# EAGLE design EAT0003 (EAGLE 7.2.0)
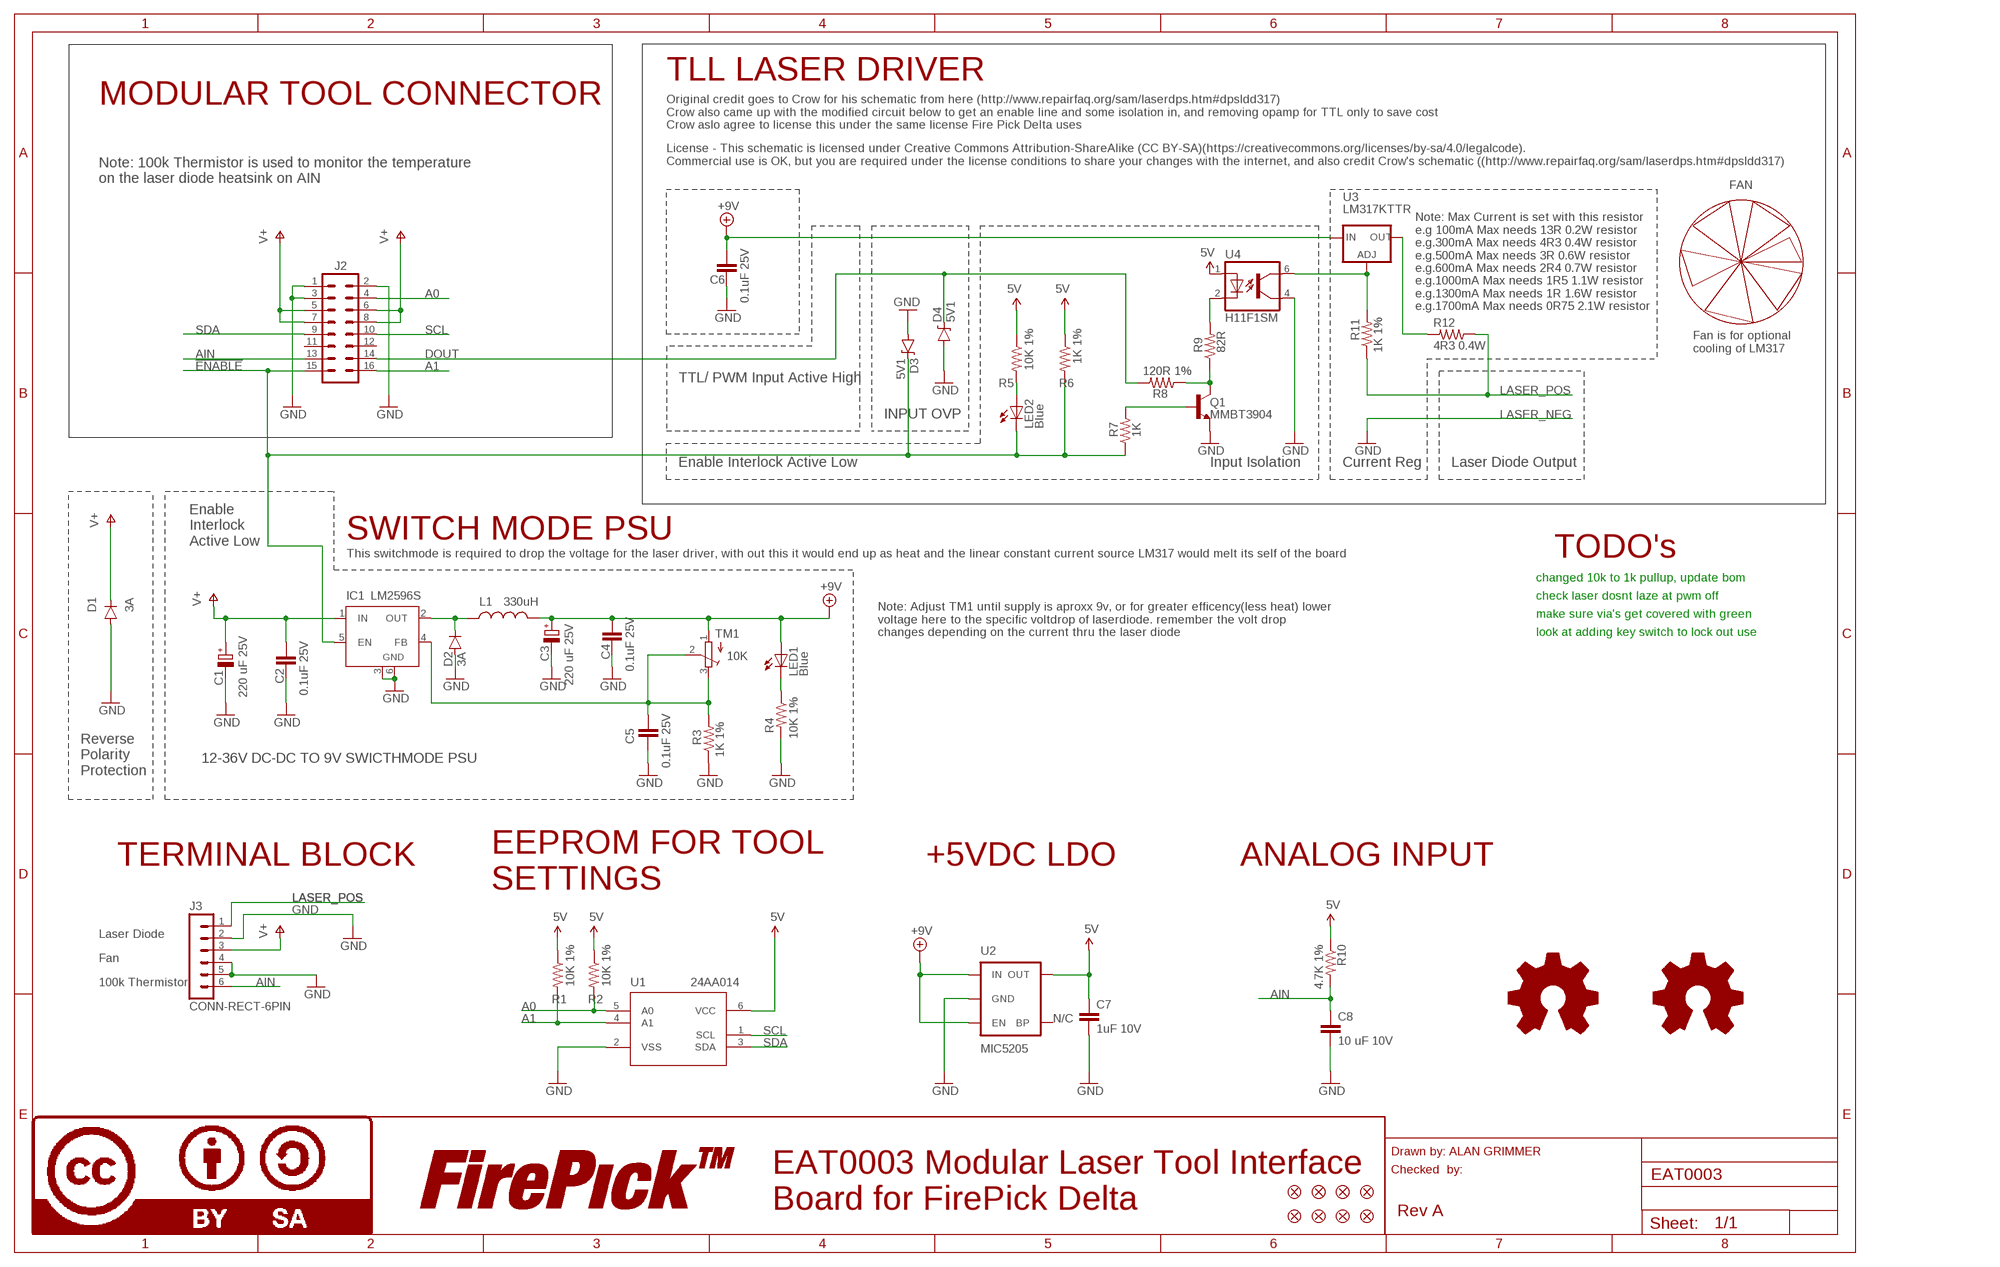
[diagram p0: schematic, sheet 1]

## Parts
C1  220 uF 25V  CPOL-EUUD-8X10  [UD-8X10_NICHICON]
C2  0.1uF 25V  CAP0603-CAP  [0603-CAP]
C3  220 uF 25V  CPOL-EUUD-8X10  [UD-8X10_NICHICON]
C4  0.1uF 25V  CAP0603-CAP  [0603-CAP]
C5  0.1uF 25V  CAP0603-CAP  [0603-CAP]
C6  0.1uF 25V  CAP0603-CAP  [0603-CAP]
C7  1uF 10V  CAP0603-CAP  [0603-CAP]
C8  10 uF 10V  CAP0805  [0805]
D1  3A  DIODESMA  [SMA-DIODE]
D2  3A  DIODESMA  [SMA-DIODE]
D3  5V1  DIODE-ZENER5.6V  [SOD-323]
D4  5V1  DIODE-ZENER5.6V  [SOD-323]
FAN1  FAN_30MM  [FAN_30MM_X_30MM]
FID1  FIDUCIAL1X2  [FIDUCIAL-1X2]
FID2  FIDUCIAL1X2  [FIDUCIAL-1X2]
FID3  FIDUCIAL1X2  [FIDUCIAL-1X2]
FID4  FIDUCIAL1X2  [FIDUCIAL-1X2]
FID5  FIDUCIAL1X2  [FIDUCIAL-1X2]
FID6  FIDUCIAL1X2  [FIDUCIAL-1X2]
FID7  FIDUCIAL1X2  [FIDUCIAL-1X2]
FID8  FIDUCIAL1X2  [FIDUCIAL-1X2]
IC1  LM2596S  [TO263-5]
J2  CONN-RECT-16PIN-2ROWSIDE  [CONN-RECT-2.54MM-16PIN-2ROW-SIDE]
J3  CONN-RECT-6PIN  [CONN-OSTTE_6PIN]
L1  330uH  INDUCTORPWR  [CDRH125]
LED1  Blue  LEDCHIPLED_0603  [CHIPLED_0603]
LED2  Blue  LEDCHIPLED_0603  [CHIPLED_0603]
LOGO1  LOGO-CC-BY-SASMALL  [LOGO-CC-BY-SA-SMALL]
LOGO2  LOGO-FIREPICKSMALL  [LOGO-FIREPICK-SMALL]
LOGO3  LOGO-OSHWSMALL  [LOGO-OSHW-SMALL]
LOGO4  LOGO-OSHWSMALL  [LOGO-OSHW-SMALL]
LOGO5  LOGO-CC-BY-SASMALL  [LOGO-CC-BY-SA-SMALL]
LOGO6  LOGO-FIREPICKSMALL  [LOGO-FIREPICK-SMALL]
Q1  MMBT3904  TRANSISTOR_NPNMMBT2222A  [SOT23-3]
R1  10K 1%  RESISTOR0603-RES  [0603-RES]
R2  10K 1%  RESISTOR0603-RES  [0603-RES]
R3  1K 1%  RESISTOR0603-RES  [0603-RES]
R4  10K 1%  RESISTOR0603-RES  [0603-RES]
R5  10K 1%  RESISTOR0603-RES  [0603-RES]
R6  1K 1%  RESISTOR0603-RES  [0603-RES]
R7  1K  RESISTOR0603-RES  [0603-RES]
R8  120R 1%  RESISTOR0603-RES  [0603-RES]
R9  82R  RESISTOR0603-RES  [0603-RES]
R10  4.7K 1%  RESISTOR0603-RES  [0603-RES]
R11  1K 1%  RESISTOR0603-RES  [0603-RES]
R12  4R3 0.4W  RESISTOR2512  [R2512]
TM1  10K  TRIMPOTTC33X  [TC33X]
U1  24AA014  IC-24AA014  [SOT23-6]
U2  MIC5205  MIC52055V  [SOT23-5]
U3  LM317KTTR  V_REG_317  [D2PAK-3]
U4  H11F1SM  H11F1DIL6SMD  [DIL6-SMD]

## Nets
5V [power]: C7.1 R1.1 R2.1 R5.1 R6.1 R10.1 U1.6(VCC) U2.5(OUT) U4.1(A)
!ENABLE: D3.C IC1.5(EN) J2.15 LED2.C R6.2 R7.1
+9V [power-12V]: C3.+ C4.1 C6.1 L1.2 LED1.A TM1.1(A) U2.1(IN) U2.3(EN) U3.3(IN)
A0: J2.4 R2.2 U1.5(A0)
A1: J2.16 R1.2 U1.4(A1)
AIN: C8.1 J2.13 J3.6 R10.2
DOUT: D4.C J2.14 R8.2
GND: C1.- C2.2 C3.- C4.2 C5.2 C6.2 C7.2 C8.2 D1.A D2.A D3.A D4.A IC1.3(GND) IC1.6(GND) J2.1 J2.2 J2.3 J3.2 J3.4 J3.5 Q1.2(E) R3.1 R4.2 U1.2(VSS) U2.2(GND) U4.4(EMIT)
LASER_POS: J3.1 R11.1 R12.1
N$1: Q1.3(C) R8.1 R9.1
N$3: D2.C IC1.2(OUT) L1.1
N$4: R11.2 U3.1(ADJ) U4.6(COL)
N$7: R12.2 U3.2(OUT) U3.PAD(OUT)
N$8: LED1.C R4.1
N$9: R9.2 U4.2(C)
N$10: Q1.1(B) R7.2
N$18: LED2.A R5.2
N$23: C5.1 IC1.4(FB) R3.2 TM1.2(S) TM1.3(E)
SCL: J2.10 U1.1(SCL)
SDA: J2.9 U1.3(SDA)
V+ [power-12V]: C1.+ C2.1 D1.C IC1.1(IN) J2.5 J2.6 J2.7 J2.8 J3.3
Unconnected: J2.11 J2.12 U2.4(BP)

## Notes on the sheet
- TLL LASER DRIVER
- MODULAR TOOL CONNECTOR
- Original credit goes to Crow for his schematic from here (http://www.repairfaq.org/sam/laserdps.htm#dpsldd317) 
  Crow also came up with the modified circuit below to get an enable line and some isolation in, and removing opamp for TTL only to save cost
  Crow aslo agree to license this under the same license Fire Pick Delta uses
- License - This schematic is licensed under Creative Commons Attribution-ShareAlike (CC BY-SA)(https://creativecommons.org/licenses/by-sa/4.0/legalcode). 
  Commercial use is OK, but you are required under the license conditions to share your changes with the internet, and also credit Crow's schematic ((http://www.repairfaq.org/sam/laserdps.htm#dpsldd317)
- Note: 100k Thermistor is used to monitor the temperature 
  on the laser diode heatsink on AIN
- FAN
- Note: Max Current is set with this resistor
  e.g 100mA Max needs 13R 0.2W resistor
  e.g.300mA Max needs 4R3 0.4W resistor
  e.g.500mA Max needs 3R 0.6W resistor
  e.g.600mA Max needs 2R4 0.7W resistor
  e.g.1000mA Max needs 1R5 1.1W resistor
  e.g.1300mA Max needs 1R 1.6W resistor
  e.g.1700mA Max needs 0R75 2.1W resistor
- Fan is for optional 
  cooling of LM317
- TTL/ PWM Input Active High
- INPUT OVP | LASER_NEG
- Enable Interlock Active Low | Input Isolation | Current Reg | Laser Diode Output
- SWITCH MODE PSU
- Enable 
  Interlock 
  Active Low
- This switchmode is required to drop the voltage for the laser driver, with out this it would end up as heat and the linear constant current source LM317 would melt its self of the board | TODO's
- changed 10k to 1k pullup, update bom
- check laser dosnt laze at pwm off
- make sure via's get covered with green
- Note: Adjust TM1 until supply is aproxx 9v, or for greater efficency(less heat) lower 
  voltage here to the specific voltdrop of laserdiode. remember the volt drop 
  changes depending on the current thru the laser diode
- look at adding key switch to lock out use
- 12-36V DC-DC TO 9V SWICTHMODE PSU
- Reverse
  Polarity
  Protection
- TERMINAL BLOCK | +5VDC LDO | ANALOG INPUT
- EEPROM FOR TOOL 
  SETTINGS
- Laser Diode
- Fan
- 100k Thermistor
- N/C
- Drawn by: ALAN GRIMMER
- Checked  by:
- EAT0003 Modular Laser Tool Interface 
  Board for FirePick Delta
- Rev A

## Library data of the parts
C1 C3 = rcl:CPOL-EU: POLARIZED CAPACITOR, European symbol
C2 C4-C8 = SparkFun-Capacitors:CAP: Capacitor Standard 0603 ceramic capacitor, and 0.1" leaded capacitor.
D1 D2 = SparkFun-DiscreteSemi:DIODE: Diode These are standard reverse protection diodes and small signal diodes. SMA package can handle up to about 1A. SOD-323 can handle about 200mA. What the SOD-323 package when ordering, there are some mfgs out there that are 5-pin packages.
D3 D4 = SparkFun-DiscreteSemi:DIODE-ZENER: Zener Diode Production Part - 8199 3.4V Zener Voltage; PROD_ID: DIO-12442; VALUE: 5.6V
FAN1 = fan:FAN_30MM
FID1-FID8 = SparkFun-Aesthetics:FIDUCIAL: Fiducial Alignment Points Various fiducial points for machine vision alignment.
IC1 = linear:LM2596S: STEP-DOWN VOLTAGE REGULATOR
J2 = FirePick:CONN-RECT-16PIN-2ROW
J3 = CONN_FPD:CONN-RECT-6PIN
L1 = SparkFun-Passives:INDUCTOR: Inductors Basic Inductor/Choke - 0603 and 1206. Footprints are not proven and vary greatly between part numbers. SRN6045- 33uH, 20% 1.4A SDR0403-560KL - 56uH, 10%, 500mA RMS/740mA peak
LED1 LED2 = adafruit:LED: LED OSRAM: - CHIPLED LG R971, LG N971, LY N971, LG Q971, LY Q971, LO R971, LY R971 LH N974, LH R974 LS Q976, LO Q976, LY Q976 LO Q996 - Hyper CHIPLED LW Q18S LB Q993, LB Q99A, LB R99A - SideLED LS A670, LO A670, LY A670, LG A670, LP A670 LB A673, LV A673, LT A673, LW A673 LH A674 LY A675 LS A676, LA A676, LO A676, LY A676, LW A676 LS A679, LY A679, LG A679 - Hyper Micro SIDELED® LS Y876, LA Y876, LO Y876, LY Y876 LT Y87S - SmartLED LW L88C, LW L88S LB L89C, LB L89S, LG L890 LS L89K, LO L89K, LY L89K LS L896, LA L896, LO L896, LY L896 - TOPLED LS T670, LO T670, LY T670, LG T670, LP T670 LSG T670, LSP T670, LSY T670, LOP T670, LYG T670 LG T671, LOG T671, LSG T671 LB T673, LV T673, LT T673, LW T673 LH T674 LS T676, LA T676, LO T676, LY T676, LB T676, LH T676, LSB T676, LW T676 LB T67C, LV T67C, LT T67C, LS T67K, LO T67K, LY T67K, LW E67C LS E67B, LA E67B, LO E67B, LY E67B, LB E67C, LV E67C, LT E67C LW T67C LS T679, LY T679, LG T679 LS T770, LO T770, LY T770, LG T770, LP T770 LB T773, LV T773, LT T773, LW T773 LH T774 LS E675, LA E675, LY E675, LS T675 LS T776, LA T776, LO T776, LY T776, LB T776 LHGB T686 LT T68C, LB T68C - Hyper Mini TOPLED® LB M676 - Mini TOPLED Santana® LG M470 LS M47K, LO M47K, LY M47K Source: http://www.osram.convergy.de/
LOGO1 LOGO5 = FirePick:LOGO-CC-BY-SA; BOM: EXCLUDE; DNP: T
LOGO2 LOGO6 = FirePick:LOGO-FIREPICK; BOM: EXCLUDE; DNP: T
LOGO3 LOGO4 = FirePick:LOGO-OSHW; BOM: EXCLUDE; DNP: TRUE
Q1 = SparkFun-DiscreteSemi:TRANSISTOR_NPN: Generic NPN BJT MMBT2222A - TRANS-08049 (SOT-23, 1A 40V) MPSA42 - TRANS-09116 (SOT-23, 500mA 300V) MMBT5088LT1G - TRANS-11160 (SOT-23, 50 mA 30V) BC547 - COM-08928 <http://www.sparkfun.com/products/8928> (TO-92 45V 100mA) (1.Collector 2.Base 3.Emitter) 2N3904 - COM-00521 <http://www.sparkfun.com/products/521> (TO-92 40V 200mA) (1.Emitter 2.Base 3.Collector) P2N2222A - COM-12852 <http://www.sparkfun.com/products/12852> (TO-92 40V 600mA) (1.Collector 2.Base 3.Emitter); PROD_ID: TRANS-08049; VALUE: MMBT2222A
R1-R12 = SparkFun-Resistors:RESISTOR: Resistor Basic schematic elements and footprints for 0603, 1206, and PTH resistors.
TM1 = adafruit:TRIMPOT: SMT trimmer potentiometer part number TC33X http://www.ladyada.net/library/eagle
U1 = FirePick:IC-24AA014
U2 = SparkFun-PowerIC:MIC5205: MIC5205 150mA vreg 3.3V - VREG-00822 5V - VREG-00823; PROD_ID: VREG-00823
U3 = LM317:V_REG_317: Voltage Regulator Standard LM317 adjustable voltage regulator. AOI (Adjust Output Input). Google 'LM317 Calculator' for easy to use app to get the two resistor values needed. 240/720 for 5V output. 240/390 for 3.3V output. Spark Fun Electronics SKU : COM-00527
U4 = H11F1SM:H11F1: OPTO COUPLER OPTO COUPLER

## Net classes
0 default: width 0.3 mm, drill 0.3 mm, clearance 0.3 mm
1 power: width 0.3 mm, drill 0.3 mm, clearance 0.3 mm
2 power-12V: width 0.3 mm, drill 0.3 mm, clearance 0.3 mm

## Board
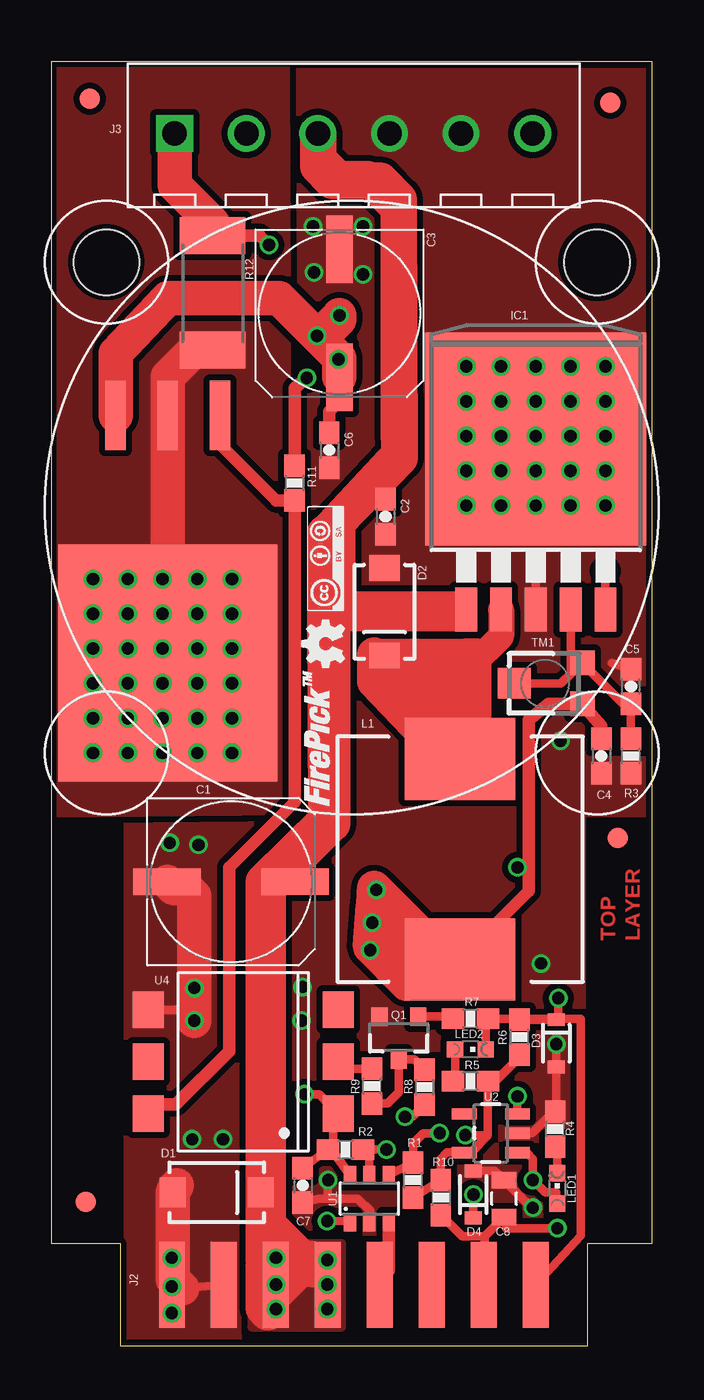
[diagram p1: board, top side]
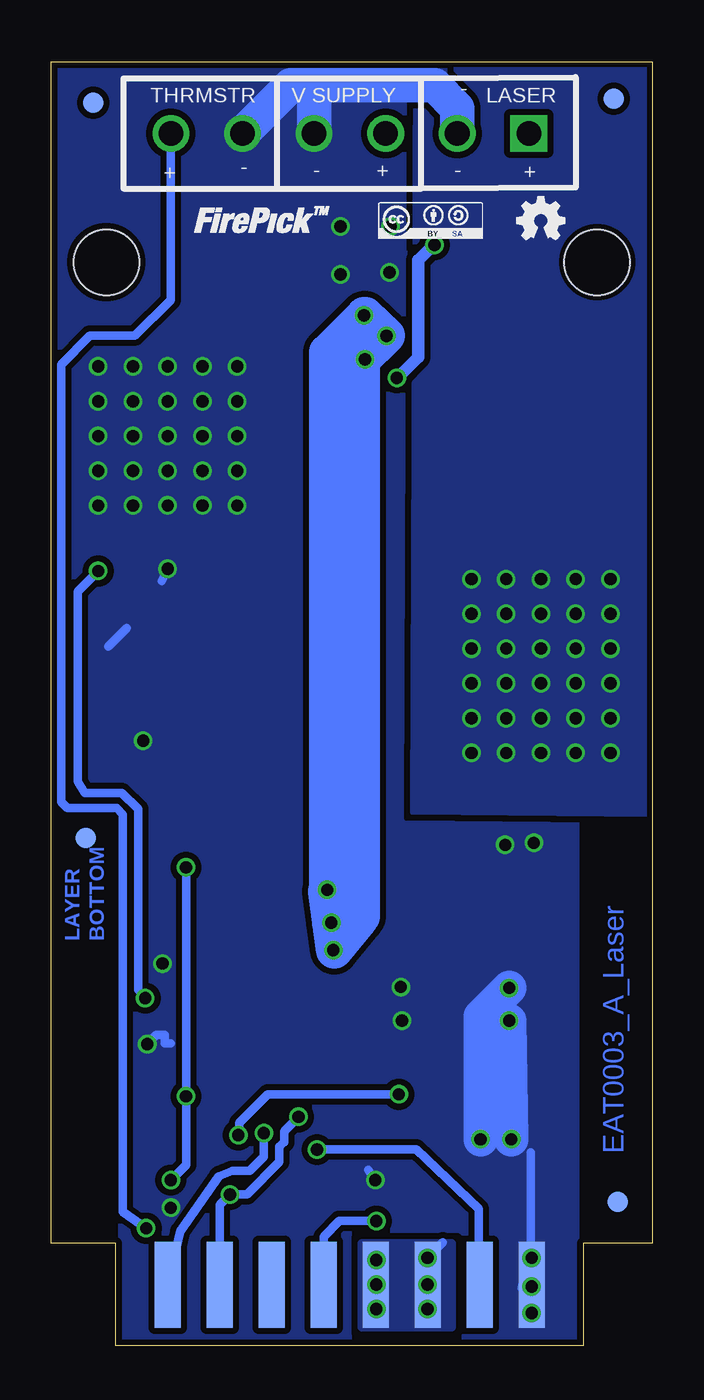
[diagram p2: board, bottom side, seen from below]

Size 29.4 x 62.8 mm. Coordinates in mm from the lower left corner, seen from the top.
Outline: 3.37,0 26.23,0 26.23,5 29.4,5 29.4,62.8 0,62.8 0,5 3.37,5 3.37,0
Copper layers (1*16): Top 0.035mm / dielectric 1.5mm / Bottom 0.035mm
Design rules "SeeedStudio_2layer_DRU_no_angle_20140221": minimum track width 6mil, minimum drill 12mil, track to track 6mil, track to pad 6mil, pad to pad 6mil, via to via 6mil, smd to smd 0mil, copper to edge 10mil, drill to drill 10mil, minimum pad ring 10mil, minimum via ring 6mil, stop-mask expansion 2mil, vias tented up to drill 100mil, thermal gap 10mil

### Footprints (pad centres in the part's own frame; a part is rotated, then mirrored left to right if it is on the bottom)
UD-8X10_NICHICON = smd 3.3 x 1.3: + 3.125,0; - -3.125,0
0603-CAP = smd 1.1 x 1: 1 -0.85,0; 2 0.85,0
0805 = smd 0.8 x 1.2: 1 -0.9,0; 2 0.9,0
SMA-DIODE = smd 1.27 x 1.47: A -2.15,0; C 2.15,0
SOD-323 = smd 0.63 x 0.83: A 1.15,0; C -1.15,0
FAN_30MM_X_30MM = hole 3.2: -12,12; 12,12
FIDUCIAL-1X2 = smd 1 x 1: 1 0,0
TO263-5 = smd 1.067 x 2.159: 1 -3.404,-5.791; 2 -1.702,-5.791; 3 0,-5.791; 4 1.702,-5.791; 5 3.404,-5.791 | smd 10.8 x 10.41: 6 0,2.54
CONN-RECT-2.54MM-16PIN-2ROW-SIDE = smd 1.27 x 4.2: 1 -8.89,-0.02; 3 -6.35,-0.02; 5 -3.81,-0.02; 7 -1.27,-0.02; 9 1.27,-0.02; 11 3.81,-0.02; 13 6.35,-0.02; 15 8.89,-0.02 | smd 1.27 x 4.2 bottom: 2 -8.89,-0.02; 4 -6.35,-0.02; 6 -3.81,-0.02; 8 -1.27,-0.02; 10 1.27,-0.02; 12 3.81,-0.02; 14 6.35,-0.02; 16 8.89,-0.02
CONN-OSTTE_6PIN = drill 1.2 square: 1 -8.758,0 | drill 1.2: 2 -5.258,0; 3 -1.758,0; 4 1.742,0; 5 5.242,0; 6 8.742,0
CDRH125 = smd 5.4 x 4: 1 0,4.9; 2 0,-4.9
CHIPLED_0603 = smd 0.8 x 0.8: A 0,-0.75; C 0,0.75
SOT23-3 = smd 0.8 x 0.9: 1 -0.95,-1; 2 0.95,-1; 3 0,1.1
0603-RES = smd 1.1 x 1: 1 -0.85,0; 2 0.85,0
R2512 = smd 1.8 x 3.2: 1 -2.8,0; 2 2.8,0
TC33X = smd 1.2 x 1.2: 1 -1,-1.825; 3 1,-1.825 | smd 1.5 x 1.6: 2 0,1.5
SOT23-6 = smd 0.6 x 0.9: 1 -0.95,-1.15; 2 0,-1.15; 3 0.95,-1.15; 4 0.95,1.15; 5 0,1.15; 6 -0.95,1.15
SOT23-5 = smd 0.55 x 1.2: 1 -0.95,-1.3; 2 0,-1.3; 3 0.95,-1.3; 4 0.95,1.3; 5 -0.95,1.3
D2PAK-3 = smd 1 x 3.4: 1 -2.55,-10.6; 2 0,-10.6; 3 2.55,-10.6 | smd 10.7 x 11.6: PAD 0,1.5
DIL6-SMD = smd 1.78 x 1.52: 1 -2.54,-4.645; 2 0,-4.645; 3 2.54,-4.645; 4 2.54,4.645; 5 0,4.645; 6 -2.54,4.645

### Placement (x,y rotation side)
C1  8.8,22.7 0 top
C2  16.35,40.55 270 top
C3  14.1,50.5 270 top
C4  26.9,28.85 270 top
C5  28.35,32.25 90 top
C6  13.6,43.8 270 top
C7  12.3,7.85 270 top
C8  22.15,7.2 90 top
D1  8.1,7.5 0 top
D2  16.3,35.9 270 top
D3  24.7,14.8 270 top
D4  20.65,7.4 90 top
FAN1  14.7,41 0 top
FID1  27.7,24.85 0 bottom
FID2  1.7,7.05 0 bottom
FID3  1.7,7.05 0 top
FID4  1.9,61 0 top
FID5  27.35,60.8 0 top
FID6  27.7,24.85 90 top
FID7  27.35,60.8 0 bottom
FID8  1.9,61 0 bottom
IC1  23.7,41.8 0 top
J2  14.8,3 0 top
J3  14.8,59.3 0 top
L1  20,23.8 0 top
LED1  24.75,7.7 0 top
LED2  20.5,14.5 270 top
LOGO1  14.3,35.95 90 top
LOGO2  13.6,26.4 90 top
LOGO3  14.55,33.1 90 top
LOGO4  6.7,53.9 0 bottom
LOGO5  13.4,54.15 0 bottom
LOGO6  22.4,54.45 0 bottom
Q1  17,15.1 180 top
R1  17.7,8.1 90 top
R2  14.4,9.6 0 top
R3  28.35,28.85 90 top
R4  24.65,10.6 90 top
R5  20.5,12.95 180 top
R6  22.9,15.1 90 top
R7  20.5,16 180 top
R8  18.25,12.65 270 top
R9  15.7,12.7 90 top
R10  19.05,7.25 270 top
R11  11.9,42.2 270 top
R12  7.9,51.5 270 top
TM1  24.15,32.4 90 top
U1  15.56,7.2 0 top
U2  21.5,10.4 90 top
U3  5.7,34.9 180 top
U4  9.4,13.9 90 top

### Tracks (layer width: path | path; a pad name or v marks a point on that pad's centre or on a via)
5V  (via drill 0.6)
  Top 0.406: R2.1 13.85,9.3 13.8,9.55 13.8,11.2 | U1.6 13.86,9.4 13.76,9.6 R2.1 | R6.1 22.65,13.85 21.75,12.95 R5.1 21.35,10.3 | 13.8,11.2 13.8,11.6 13.1,12.3 v12.4,12.3 | C7.1 R2.1 | 19.85,9.5 U2.5 | 21.35,10.3 20.6,9.5 19.95,9.5 U2.5 | 21.35,10.3 v20.25,10.3 | U4.1 13.98,11.2 13.8,11.2 | R1.1 R10.1 19.05,9.15 19.35,9.45 U2.5
  Top 0.61: R2.1 13.64,9.7
  Bottom 0.406: v12.4,12.3 18.8,12.3 20.2,10.9 20.2,10.35 v20.25,10.3
!ENABLE  (via drill 0.6)
  Top 0.406: J2.15 25.9,5.39 25.9,16 24.8,16 | LED2.C 21.25,15.9 R7.1 | 24.8,16 v24.8,17 | v27.1,37.9 IC1.5 | 24.8,16 D3.C 24.55,16 24.4,16 | 24.4,16 R7.1 | R7.1 21.3,16 | 24.4,16 24.35,15.95 R6.2 22.85,16 R7.1
  Top 0.61: IC1.5
  Bottom 0.406: v27.1,37.9 28.1,36.9 28.1,27.6 27.75,27.05 25.95,27.05 25.15,26.25 25.15,17.4 v24.8,17
+9V  (via drill 0.6)
  Top 0.406: 22.45,11.3 U2.3 22.8,12 v22.8,12.2 | U2.1 22.5,9.45 23.25,9.45 23.55,9.15 v23.55,8.1 | 23.55,8.35 v23.55,8.1 | LED1.A 24.7,7.5 24.15,7.5 v23.55,8.1 | 15.6,19.5 v15.6,19.35 | 15.79,22.26 15.78,22.09 | 15.8,22.4 15.78,22.09 | 15.78,22.09 15.6,19.6 15.6,19.55 v15.9,22.3 14.95,19.55 15.1,21.55 15.78,21.15 15.78,22.09 | v14.05,48.25 C3.+
  Top 0.61: 23.35,23.35 23.35,30.6 24.3,31.4 TM1.1 26.9,30.32 C4.1 | L1.2 23.35,22.25 23.35,23.35 | v22.8,23.4 22.85,23.35 23.35,23.35 | C3.+ 14.1,46.95 14.2,46.85 14.2,46.3 13.6,45.7 C6.1
  Top 1.676: C3.+ 14.1,48.3 13.15,49.25 | 13.15,49.25 v13,49.4 | U3.3 3.15,48.55 5.7,51.25 11.15,51.25 v13,49.4 | v14.1,50.4 14.1,50.2 13.15,49.25 | v15.7,20.7 17.5,18.9 L1.2 19.3,18.9 v15.9,22.3 15.6,19.6 15.74,21.57 15.78,22.09 15.79,22.2 15.79,22.25 15.79,22.26 15.8,22.4 | v13,49.4 13.1,49.4 14,50.3 | 17.4,17.7 15.6,19.5
  Bottom 0.406: v22.8,23.4 v22.8,12.2 22.8,8.85 v23.55,8.1 | v15.9,22.3 15.95,22.25 | 15.85,22.3 15.8,22.4 | 15.8,22.4 v15.6,19.35 | 15.8,22.4 15.79,22.25 | 15.79,22.25 15.77,22.04 15.71,21.13 15.79,22.25 | 15.79,22.25 15.73,22.25 15.73,21.44 15.7,21.44 15.7,21.02 15.67,21.02 15.67,20.57 15.6,20.57 15.6,19.55 | 15.6,19.55 15.8,19.55 15.8,22.4 | 15.6,19.55 15.2,19.55 15.2,34.7 15.8,34.7 15.8,22.4
  Bottom 1.778: v15.9,22.3 15.9,48.6 v14.1,50.4 | 14.2,22.2 14.2,48.2 v13,49.4 | 14.2,22.2 15.8,22.2 v15.9,22.3 | v15.9,22.3 14.2,22.2 | 14.2,22.2 v15.7,20.7 | v15.7,20.7 15.75,20.65 15.85,22.3 v15.7,20.7 | v13,49.4 14.05,50.4 15.05,48 v13,49.4 | 14.3,20.85 15.55,19.35 15.95,22.25 | 14.2,21 14.2,22.2
A0  (via drill 0.6)
  Top 0.406: R2.2 15.56,9.49 U1.5 15.56,9.44 15.6,9.6 v16.4,9.6
  Bottom 0.406: v16.4,9.6 11.55,9.6 8.5,6.7 8.5,3.03 J2.4
  Bottom 0.61: J2.4 8.4,3.03
A1  (via drill 0.6)
  Top 0.406: 18.55,10.4 v19,10.4 18.2,10.4 17.7,9.9 R1.2 U1.4 16.55,8.39 16.55,8.45
  Bottom 0.406: J2.16 23.09,5.61 21.2,8.3 20.55,8.55 19.7,8.55 19,9.25 v19,10.4
AIN  (via drill 0.6)
  Top 0.406: 21.2,5.35 C8.1 22.25,6.2 22.25,5.75 v24.75,5.75 | 21.2,5.35 21.2,4 | R10.2 20.1,5.35 21.2,5.35
  Top 0.61: 21.2,4 21.2,3.03 J2.13
  Bottom 0.406: J3.6 23.54,51.16 25.3,49.4 27.5,49.4 28.9,48 28.9,26.6 28.6,26.3 26.2,26.3 25.9,26 25.9,6.55 v24.75,5.75
DOUT  (via drill 0.6)
  Top 0.406: v20.65,7.4 D4.C | v17.3,11.2 17.65,11.2 R8.2
  Bottom 0.406: J2.14 21.15,6.9 v20.65,7.4 19.8,7.4 18.25,9 18.25,9.75 18,9.95 18,10.5 v17.3,11.2
GND  (via drill 0.6)
  Top 0.406: U1.2 15.6,6.09 15.6,6.6 15,7.2 13.5,7.2 | 13.5,7.2 v13.55,8.1 | C7.2 13.05,7.2 13.5,7.2 | IC1.3 v23.7,38 | C5.2 27.4,33.4 | D4.A 21.7,8.55 C8.2 23.4,6.85 v23.55,6.75 | v7,15.9 6.46,16.44 U4.4 | J2.3 6.4,2.8 J2.2 | U2.2 23.5,10.4 24.6,11.5 R4.2 24.65,11.3 24.7,11.3 D3.A v24.7,14.75
  Top 1.676: 6.4,2.8 5.95,3.25 D1.A 6.15,7.85 | C1.- 5.98,22.4 6.6,22.4 7,22 v7,17.5 v7,15.9
  Bottom 0.406: v13.55,8.1 13.9,8.6 | v24.7,14.75 24.25,15.2 23.85,15.2 23.85,14.8 23.55,14.8 | v23.7,38 24,37.4 | 26.6,34.2 25.7,35.1 | J2.2 6.4,2.8 5.95,4.75 5.95,9.45
  Bottom 1.676: v8.4,10.1 8.4,16.1 v7,17.5 | v7,15.9 v6.9,10.1 | J3.2 9.54,60.54 10.65,61.65 16.7,61.65 | 16.7,61.65 17.69,61.65 J3.5 | J3.4 16.54,61.49 16.7,61.65
  other vias: 5.9,4.3 5.9,2.9 5.9,1.6 12.3,17.55 12.25,15.9 20.3,47.9 15.25,54.75 12.8,54.75 22,47.9 25.4,47.9 23.7,47.9 27.1,47.9 27.1,46.2 27.1,44.5 27.1,42.8 27.1,41.1 25.4,41.1 23.7,41.1 22,41.1 20.3,41.1 20.3,42.8 20.3,44.5 20.3,46.2 22,46.2 23.7,46.2 25.4,46.2 25.4,44.5 23.7,44.5 22,44.5 22,42.8 23.7,42.8 12.85,52.5 15.25,52.4 23.95,18.7 24.9,29.6 25.4,42.8 7.2,24.5 5.8,24.6
  pour Top (isolate 0.3, rank 2, no thermals): 0.2,62.6 29.3,62.6 29.3,26 26,26 26,0 3.7,0 3.7,26 0.2,26
  pour Bottom (isolate 0.3, rank 2, no thermals): 29.3,62.6 29.3,26 26,26 26,0.2 3.7,0.2 3.7,26 0.2,26 0.2,62.6
LASER_POS  (via drill 0.6)
  Top 0.61: v10.65,53.85 10.2,54.3 R12.1 7.9,54.9 | v12.5,47.35 11.9,46.85 R11.1
  Top 1.676: J3.1 6.04,56.76 7.9,54.9
  Bottom 0.61: v10.65,53.85 10.75,53.8 11.45,53.1 11.45,48.35 12.4,47.4 v12.5,47.35
N$1
  Top 0.406: R9.1 16.45,11.85 17,12.4 Q1.3 17.75,14 R8.1
N$3
  Top 1.27: IC1.2 22,34.7 20.65,33.35 20.65,30.7 20.9,30.4 20.9,33.95 20.2,33.95 20,33.75
  Top 1.676: L1.1 20,33.75 18.8,33.75 18.8,30.5 18.9,30.4 17.8,30.4 15.8,32.5 15.8,33.8 18,31.45 17.6,32.7 18.65,33.75 | 20.65,33.75 18.65,33.75 | 18.65,33.75 D2.C
N$4
  Top 0.406: U4.6 4.75,11.74 4.7,11.8 4.76,11.86 4.8,11.82 4.8,11.8
  Top 0.61: 4.8,11.8 6.1,11.8 8.7,14.4 8.7,23.4 11.9,26.6 R11.2 11,41.35 8.25,44.1 U3.1
N$7  (via drill 0.6)
  Top 1.676: R12.2 7,48.7 5.7,47.4 U3.2 U3.PAD
  other vias: 2.05,37.5 3.75,37.5 5.45,37.5 7.15,37.5 8.85,37.5 2.05,35.8 2.05,34.1 2.05,32.4 2.05,30.7 2.05,29 5.45,29 3.75,29 3.75,30.7 3.75,32.4 3.75,34.1 3.75,35.8 5.45,35.8 5.45,34.1 5.45,32.4 5.45,30.7 7.15,30.7 7.15,29 8.85,29 8.85,30.7 8.85,32.4 8.85,34.1 8.85,35.8 7.15,35.8 7.15,34.1 7.15,32.4
  pour Top (no thermals): 11.7,26.1 11.55,62.75 0.05,62.8 0,26
  pour Bottom (no thermals): 11.7,26.1 11.55,62.75 0.05,62.8 0,26
N$8
  Top 0.406: LED1.C 24.75,9.75 R4.1
N$9
  Top 0.406: 14.45,13.8 14.7,13.55 R9.2
  Top 0.61: U4.2 14.45,13.8
N$10
  Top 0.406: R7.2 19.55,16.1 Q1.1
N$18
  Top 0.406: R5.2 19.75,12.95 | 19.75,12.95 19.75,12.9 | 19.75,12.95 LED2.A
N$23
  Top 0.406: IC1.4 25.4,33.08 TM1.3 | TM1.3 24.93,32.4 TM1.2 | 26.3,33.05 26.18,33.05 TM1.3 | R3.2 C5.1 27.97,31.4 TM1.3
SCL  (via drill 0.6)
  Top 0.406: v13.5,6.1 14.61,6.09
  Top 0.61: 14.61,6.09 U1.1
  Bottom 0.406: 16.07,4.33 16.07,5.33 15.3,6.1 v13.5,6.1
  Bottom 0.61: J2.10 16.07,4.33
SDA
  Top 0.61: J2.9 16.51,3.67 U1.3
V+  (via drill 0.6)
  Top 0.406: 10.99,3.18 10.6,3.57 10.6,3.77 | v11,1.8 v10.99,1.81 J2.6 v11,3 | v11,4.3 10.9,4.2 10.4,4.2 | 19.7,36 IC1.1 | D1.C 10.6,7.05
  Top 0.61: 10.4,22.7 10.45,22.7 C1.+ | C2.1 16.4,42.95 16.4,43.7 16.47,43.73 16.97,43.59
  Top 1.676: 13.4,39.75 16.97,43.59 16.95,45 16.95,55.64 15.49,57.1 14.05,57.1 13.04,58.11 J3.3 | 10.4,4.2 10.4,3.9 | 13.66,36.01 13.4,35.95
  Top 1.778: 10.4,4.2 10.4,22.7 13.45,25.7 13.4,35.95 13.4,39.75 | 13.66,36.01 19.7,36 | 10.4,3.9 10.4,1.85 10.6,1.65 10.6,2.2 12.65,4.25 12.8,3.75 10.6,5.95 10.55,6.6 | 10.55,6.85 10.55,6.6 | 10.55,6.6 10.4,6.3 10.55,6.3 10.6,6.25 10.6,7.05 10.6,22.4 13.75,25.55 13.75,35.85 19.9,35.85 14.55,36 14,36.55 14,40.3 17.05,43.45 17,56.05 16.1,57 13.75,57 13.05,57.7 13.05,59.2
  Bottom 0.406: v11,4.3 10.25,5.05
  other vias: 13.5,1.8 13.5,4.2 13.5,3
  pour Top (no thermals): 14.2,0.9 14.2,5 9.8,5 9.8,0.9
  pour Bottom (no thermals): 14.2,5 9.8,5 9.8,0.9 14.2,0.9

### Text on the board
Top: TOP | LAYER
Bottom: BOTTOM | LAYER | EAT0003_A_Laser
bPlace: LASER | - | V SUPPLY | THRMSTR | + | - | + | - | - | +
tDocu: EAT0003_A_Laser
bDocu: EAT0003_A_Laser